# EAGLE design LedPanel (EAGLE 6.5.0)
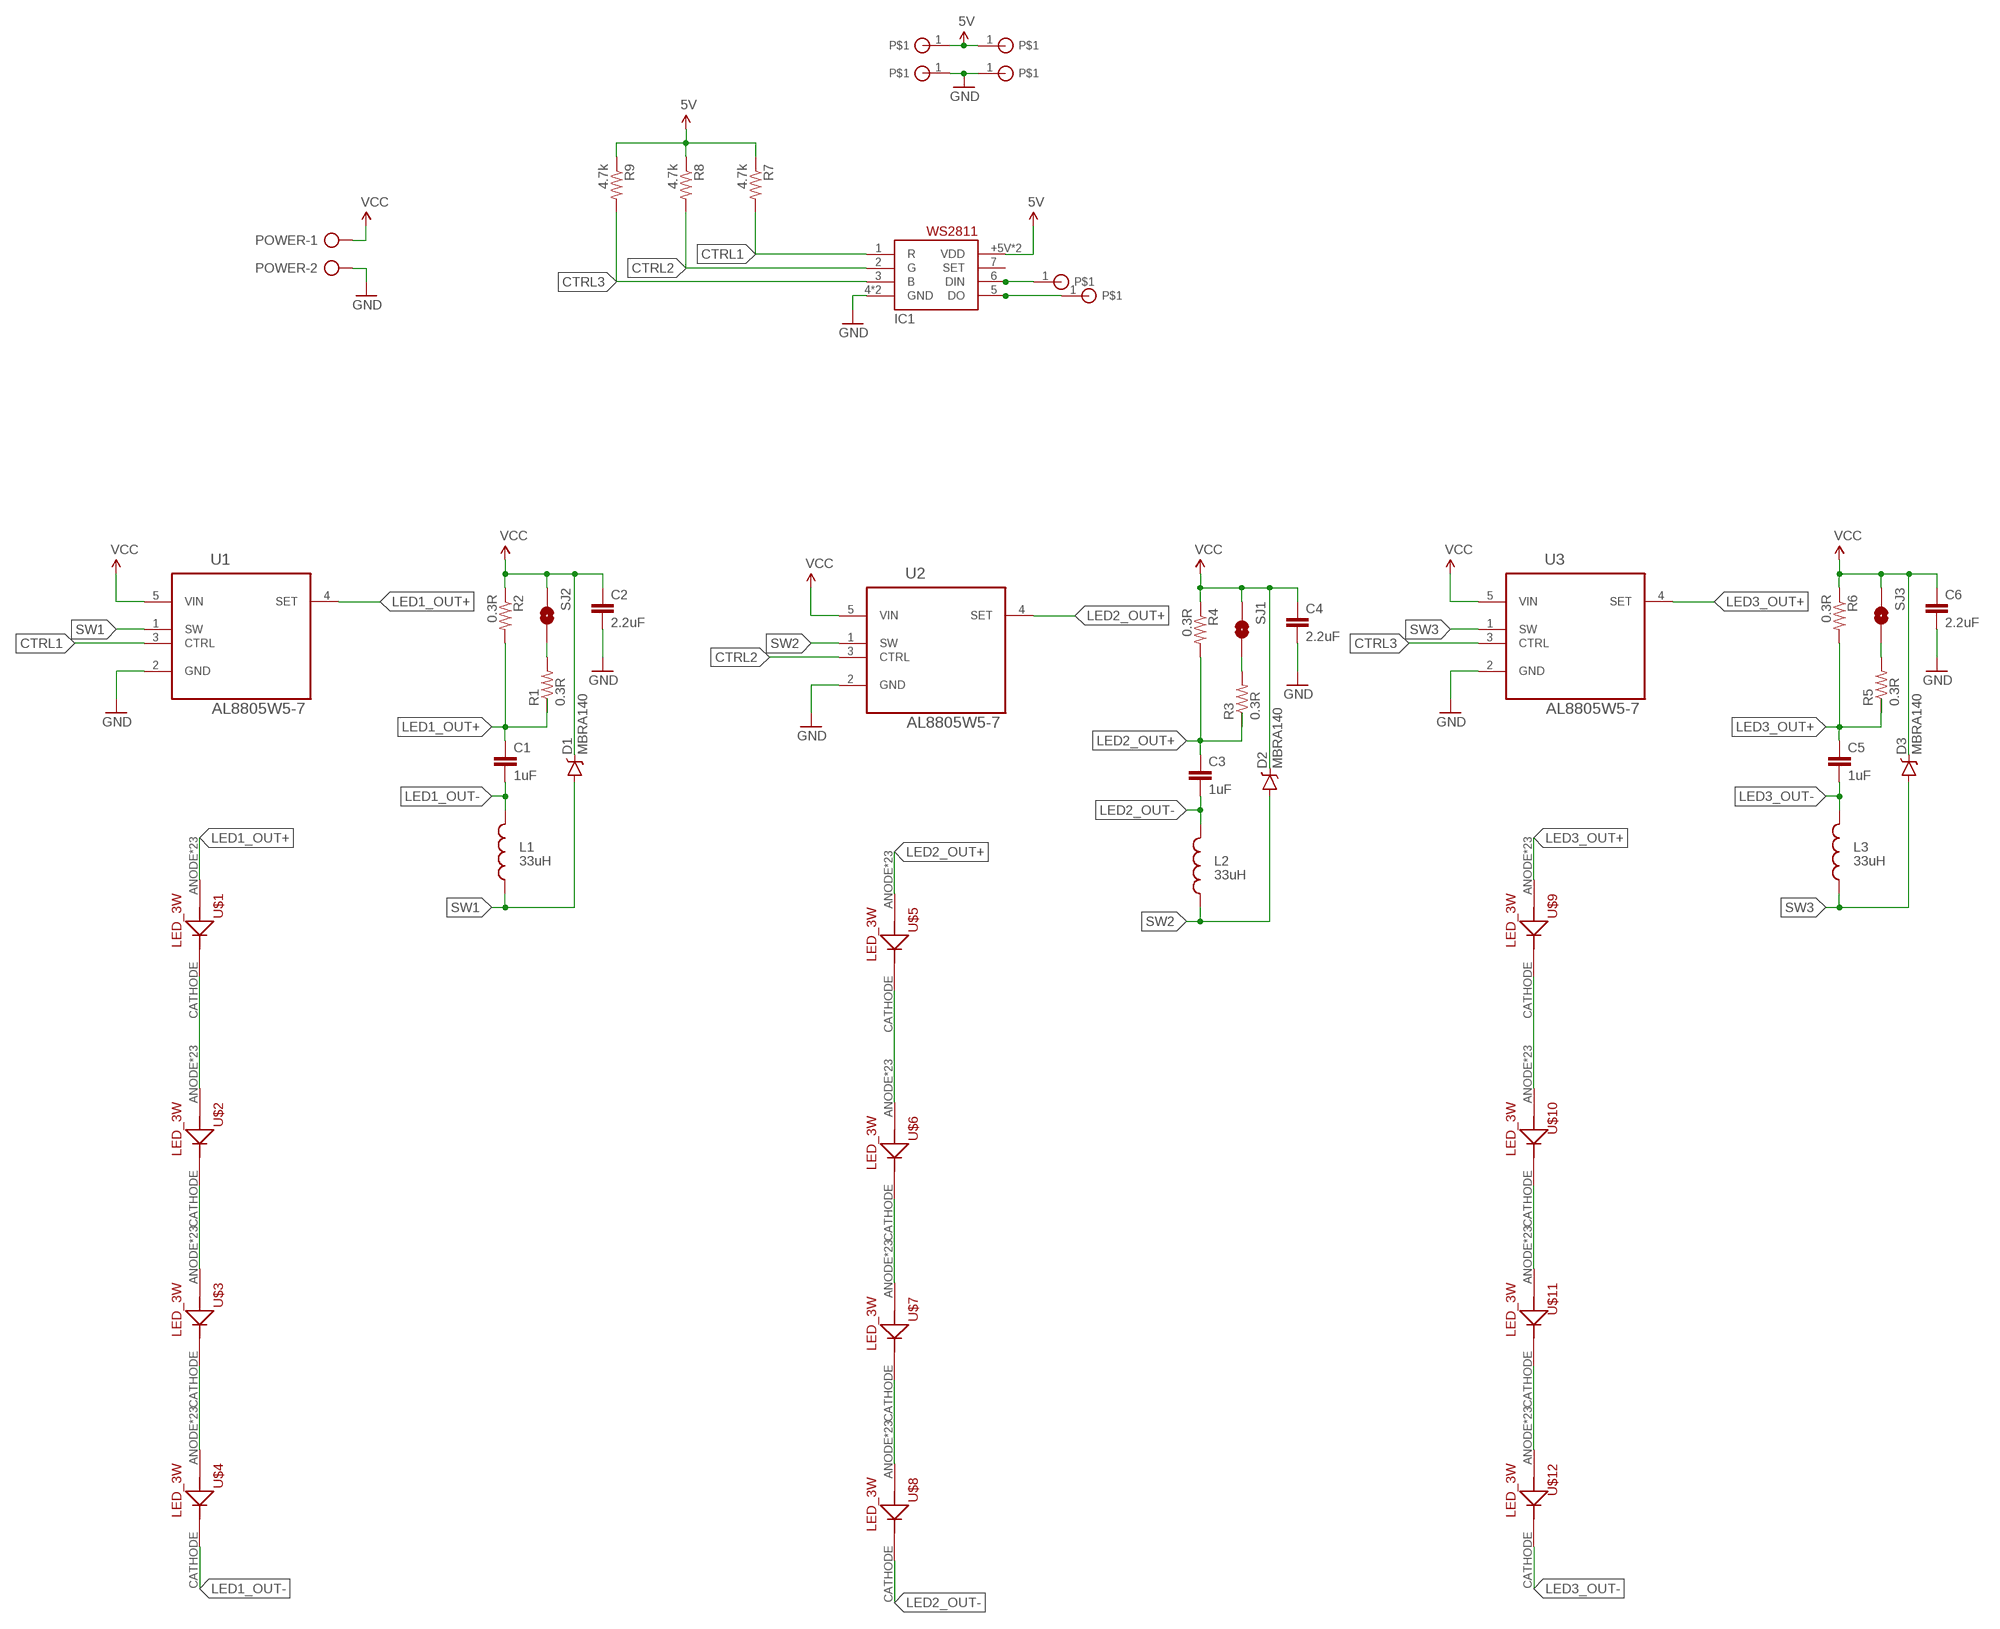
[diagram p0: schematic, sheet 1]

## Parts
5V  5V  SOLDER_PAD  [SOLDER_PAD]
C1  1uF  1.0UF50V10%(1206)  [1206-CAP]
C2  2.2uF  2.2UF50V10%(1206)  [1206-CAP]
C3  1uF  1.0UF50V10%(1206)  [1206-CAP]
C4  2.2uF  2.2UF50V10%(1206)  [1206-CAP]
C5  1uF  1.0UF50V10%(1206)  [1206-CAP]
C6  2.2uF  2.2UF50V10%(1206)  [1206-CAP]
D1  MBRA140  DIODE-SCHOTTKY-MBRA140  [SMA-DIODE]
D2  MBRA140  DIODE-SCHOTTKY-MBRA140  [SMA-DIODE]
D3  MBRA140  DIODE-SCHOTTKY-MBRA140  [SMA-DIODE]
DI  DI  SOLDER_PAD  [SOLDER_PAD]
DO  DO  SOLDER_PAD  [SOLDER_PAD]
IC1  WS2811-SOP8  [SO08-SKINNYPADS]
L1  33uH  INDUCTORBOURNS_SRN6045  [SRN6045]
L2  33uH  INDUCTORBOURNS_SRN6045  [SRN6045]
L3  33uH  INDUCTORBOURNS_SRN6045  [SRN6045]
POWER  AK500/2  [AK500/2]
R1  0.3R  0.3OHM-1/8W-1%(0805)  [0805]
R2  0.3R  0.3OHM-1/8W-1%(0805)  [0805]
R3  0.3R  0.3OHM-1/8W-1%(0805)  [0805]
R4  0.3R  0.3OHM-1/8W-1%(0805)  [0805]
R5  0.3R  0.3OHM-1/8W-1%(0805)  [0805]
R6  0.3R  0.3OHM-1/8W-1%(0805)  [0805]
R7  4.7k  0.3OHM-1/8W-1%(0805)  [0805]
R8  4.7k  0.3OHM-1/8W-1%(0805)  [0805]
R9  4.7k  0.3OHM-1/8W-1%(0805)  [0805]
SJ1  NO Jumper  JUMPER-PAD-2-NO  [PAD-JUMPER-2-NO_NO_SILK]
SJ2  NO Jumper  JUMPER-PAD-2-NO  [PAD-JUMPER-2-NO_NO_SILK]
SJ3  NO Jumper  JUMPER-PAD-2-NO  [PAD-JUMPER-2-NO_NO_SILK]
U1  AL8805W5-7  [SOT95P280X130-5N]
U2  AL8805W5-7  [SOT95P280X130-5N]
U3  AL8805W5-7  [SOT95P280X130-5N]
U$1  LED_3W  [LED_3W]
U$2  LED_3W  [LED_3W]
U$3  LED_3W  [LED_3W]
U$4  LED_3W  [LED_3W]
U$5  LED_3W  [LED_3W]
U$6  LED_3W  [LED_3W]
U$7  LED_3W  [LED_3W]
U$8  LED_3W  [LED_3W]
U$9  LED_3W  [LED_3W]
U$10  LED_3W  [LED_3W]
U$11  LED_3W  [LED_3W]
U$12  LED_3W  [LED_3W]
U$15  GND  SOLDER_PAD  [SOLDER_PAD]
U$16  5V  SOLDER_PAD  [SOLDER_PAD]
U$18  GND  SOLDER_PAD  [SOLDER_PAD]

## Nets
5V: 5V.1 IC1.8(VDD) IC1.+5V(VDD) R7.1 R8.1 R9.1 U$16.1
CTRL1: IC1.1(R) R7.2 U1.3(CTRL)
CTRL2: IC1.2(G) R8.2 U2.3(CTRL)
CTRL3: IC1.3(B) R9.2 U3.3(CTRL)
GND: C2.2 C4.2 C6.2 IC1.4(GND) IC1.GND POWER.2 U1.2(GND) U2.2(GND) U3.2(GND) U$15.1 U$18.1
LED1_OUT+: C1.1 R1.1 R2.2 U1.4(SET) U$1.ANODE U$1.P$1(ANODE) U$1.P$2(ANODE) U$1.P$3(ANODE) U$1.P$4(ANODE) U$1.P$5(ANODE) U$1.P$6(ANODE) U$1.P$7(ANODE) U$1.P$8(ANODE) U$1.P$9(ANODE) U$1.P$10(ANODE) U$1.P$11(ANODE) U$1.P$12(ANODE) U$1.P$13(ANODE) U$1.P$14(ANODE) U$1.P$15(ANODE) U$1.P$16(ANODE) U$1.P$17(ANODE) U$1.P$18(ANODE) U$1.P$19(ANODE) U$1.P$20(ANODE) U$1.P$21(ANODE) U$1.SLUG(ANODE)
LED1_OUT- [power]: C1.2 L1.2 U$4.CATHODE
LED2_OUT+: C3.1 R3.1 R4.2 U2.4(SET) U$5.ANODE U$5.P$1(ANODE) U$5.P$2(ANODE) U$5.P$3(ANODE) U$5.P$4(ANODE) U$5.P$5(ANODE) U$5.P$6(ANODE) U$5.P$7(ANODE) U$5.P$8(ANODE) U$5.P$9(ANODE) U$5.P$10(ANODE) U$5.P$11(ANODE) U$5.P$12(ANODE) U$5.P$13(ANODE) U$5.P$14(ANODE) U$5.P$15(ANODE) U$5.P$16(ANODE) U$5.P$17(ANODE) U$5.P$18(ANODE) U$5.P$19(ANODE) U$5.P$20(ANODE) U$5.P$21(ANODE) U$5.SLUG(ANODE)
LED2_OUT- [power]: C3.2 L2.2 U$8.CATHODE
LED3_OUT+: C5.1 R5.1 R6.2 U3.4(SET) U$9.ANODE U$9.P$1(ANODE) U$9.P$2(ANODE) U$9.P$3(ANODE) U$9.P$4(ANODE) U$9.P$5(ANODE) U$9.P$6(ANODE) U$9.P$7(ANODE) U$9.P$8(ANODE) U$9.P$9(ANODE) U$9.P$10(ANODE) U$9.P$11(ANODE) U$9.P$12(ANODE) U$9.P$13(ANODE) U$9.P$14(ANODE) U$9.P$15(ANODE) U$9.P$16(ANODE) U$9.P$17(ANODE) U$9.P$18(ANODE) U$9.P$19(ANODE) U$9.P$20(ANODE) U$9.P$21(ANODE) U$9.SLUG(ANODE)
LED3_OUT- [power]: C5.2 L3.2 U$12.CATHODE
N$1: U$3.CATHODE U$4.ANODE U$4.P$1(ANODE) U$4.P$2(ANODE) U$4.P$3(ANODE) U$4.P$4(ANODE) U$4.P$5(ANODE) U$4.P$6(ANODE) U$4.P$7(ANODE) U$4.P$8(ANODE) U$4.P$9(ANODE) U$4.P$10(ANODE) U$4.P$11(ANODE) U$4.P$12(ANODE) U$4.P$13(ANODE) U$4.P$14(ANODE) U$4.P$15(ANODE) U$4.P$16(ANODE) U$4.P$17(ANODE) U$4.P$18(ANODE) U$4.P$19(ANODE) U$4.P$20(ANODE) U$4.P$21(ANODE) U$4.SLUG(ANODE)
N$2: U$2.CATHODE U$3.ANODE U$3.P$1(ANODE) U$3.P$2(ANODE) U$3.P$3(ANODE) U$3.P$4(ANODE) U$3.P$5(ANODE) U$3.P$6(ANODE) U$3.P$7(ANODE) U$3.P$8(ANODE) U$3.P$9(ANODE) U$3.P$10(ANODE) U$3.P$11(ANODE) U$3.P$12(ANODE) U$3.P$13(ANODE) U$3.P$14(ANODE) U$3.P$15(ANODE) U$3.P$16(ANODE) U$3.P$17(ANODE) U$3.P$18(ANODE) U$3.P$19(ANODE) U$3.P$20(ANODE) U$3.P$21(ANODE) U$3.SLUG(ANODE)
N$3: U$1.CATHODE U$2.ANODE U$2.P$1(ANODE) U$2.P$2(ANODE) U$2.P$3(ANODE) U$2.P$4(ANODE) U$2.P$5(ANODE) U$2.P$6(ANODE) U$2.P$7(ANODE) U$2.P$8(ANODE) U$2.P$9(ANODE) U$2.P$10(ANODE) U$2.P$11(ANODE) U$2.P$12(ANODE) U$2.P$13(ANODE) U$2.P$14(ANODE) U$2.P$15(ANODE) U$2.P$16(ANODE) U$2.P$17(ANODE) U$2.P$18(ANODE) U$2.P$19(ANODE) U$2.P$20(ANODE) U$2.P$21(ANODE) U$2.SLUG(ANODE)
N$4: U$7.CATHODE U$8.ANODE U$8.P$1(ANODE) U$8.P$2(ANODE) U$8.P$3(ANODE) U$8.P$4(ANODE) U$8.P$5(ANODE) U$8.P$6(ANODE) U$8.P$7(ANODE) U$8.P$8(ANODE) U$8.P$9(ANODE) U$8.P$10(ANODE) U$8.P$11(ANODE) U$8.P$12(ANODE) U$8.P$13(ANODE) U$8.P$14(ANODE) U$8.P$15(ANODE) U$8.P$16(ANODE) U$8.P$17(ANODE) U$8.P$18(ANODE) U$8.P$19(ANODE) U$8.P$20(ANODE) U$8.P$21(ANODE) U$8.SLUG(ANODE)
N$5: U$6.CATHODE U$7.ANODE U$7.P$1(ANODE) U$7.P$2(ANODE) U$7.P$3(ANODE) U$7.P$4(ANODE) U$7.P$5(ANODE) U$7.P$6(ANODE) U$7.P$7(ANODE) U$7.P$8(ANODE) U$7.P$9(ANODE) U$7.P$10(ANODE) U$7.P$11(ANODE) U$7.P$12(ANODE) U$7.P$13(ANODE) U$7.P$14(ANODE) U$7.P$15(ANODE) U$7.P$16(ANODE) U$7.P$17(ANODE) U$7.P$18(ANODE) U$7.P$19(ANODE) U$7.P$20(ANODE) U$7.P$21(ANODE) U$7.SLUG(ANODE)
N$6: R1.2 SJ2.2
N$7: U$5.CATHODE U$6.ANODE U$6.P$1(ANODE) U$6.P$2(ANODE) U$6.P$3(ANODE) U$6.P$4(ANODE) U$6.P$5(ANODE) U$6.P$6(ANODE) U$6.P$7(ANODE) U$6.P$8(ANODE) U$6.P$9(ANODE) U$6.P$10(ANODE) U$6.P$11(ANODE) U$6.P$12(ANODE) U$6.P$13(ANODE) U$6.P$14(ANODE) U$6.P$15(ANODE) U$6.P$16(ANODE) U$6.P$17(ANODE) U$6.P$18(ANODE) U$6.P$19(ANODE) U$6.P$20(ANODE) U$6.P$21(ANODE) U$6.SLUG(ANODE)
N$8: R3.2 SJ1.2
N$9: U$11.CATHODE U$12.ANODE U$12.P$1(ANODE) U$12.P$2(ANODE) U$12.P$3(ANODE) U$12.P$4(ANODE) U$12.P$5(ANODE) U$12.P$6(ANODE) U$12.P$7(ANODE) U$12.P$8(ANODE) U$12.P$9(ANODE) U$12.P$10(ANODE) U$12.P$11(ANODE) U$12.P$12(ANODE) U$12.P$13(ANODE) U$12.P$14(ANODE) U$12.P$15(ANODE) U$12.P$16(ANODE) U$12.P$17(ANODE) U$12.P$18(ANODE) U$12.P$19(ANODE) U$12.P$20(ANODE) U$12.P$21(ANODE) U$12.SLUG(ANODE)
N$10: U$10.CATHODE U$11.ANODE U$11.P$1(ANODE) U$11.P$2(ANODE) U$11.P$3(ANODE) U$11.P$4(ANODE) U$11.P$5(ANODE) U$11.P$6(ANODE) U$11.P$7(ANODE) U$11.P$8(ANODE) U$11.P$9(ANODE) U$11.P$10(ANODE) U$11.P$11(ANODE) U$11.P$12(ANODE) U$11.P$13(ANODE) U$11.P$14(ANODE) U$11.P$15(ANODE) U$11.P$16(ANODE) U$11.P$17(ANODE) U$11.P$18(ANODE) U$11.P$19(ANODE) U$11.P$20(ANODE) U$11.P$21(ANODE) U$11.SLUG(ANODE)
N$11: U$9.CATHODE U$10.ANODE U$10.P$1(ANODE) U$10.P$2(ANODE) U$10.P$3(ANODE) U$10.P$4(ANODE) U$10.P$5(ANODE) U$10.P$6(ANODE) U$10.P$7(ANODE) U$10.P$8(ANODE) U$10.P$9(ANODE) U$10.P$10(ANODE) U$10.P$11(ANODE) U$10.P$12(ANODE) U$10.P$13(ANODE) U$10.P$14(ANODE) U$10.P$15(ANODE) U$10.P$16(ANODE) U$10.P$17(ANODE) U$10.P$18(ANODE) U$10.P$19(ANODE) U$10.P$20(ANODE) U$10.P$21(ANODE) U$10.SLUG(ANODE)
N$12: R5.2 SJ3.2
N$13: DI.1 IC1.6(DIN)
N$14: DO.1 IC1.5(DO)
SW1: D1.A L1.1 U1.1(SW)
SW2: D2.A L2.1 U2.1(SW)
SW3: D3.A L3.1 U3.1(SW)
VCC: C2.1 C4.1 C6.1 D1.C D2.C D3.C POWER.1 R2.1 R4.1 R6.1 SJ1.1 SJ2.1 SJ3.1 U1.5(VIN) U2.5(VIN) U3.5(VIN)
Unconnected: IC1.7(SET)

## Library data of the parts
5V DI DO U$15 U$16 U$18 = LedPanel:SOLDER_PAD
C1 C3 C5 = SparkFun-Capacitors:1.0UF50V10%(1206): CAP-09822
C2 C4 C6 = SparkFun-Capacitors:2.2UF50V10%(1206): CAP-10009
D1-D3 = SparkFun-DiscreteSemi:DIODE-SCHOTTKY: Schottky diodes in SFE's production catalog BAT20J 1A 23V 0.62Vf RB751 120mA 40V 0.37Vf PMEG4005EJ 0.5A 40V 0.42Vf MBRA140 1A 40V 0.5Vf B340A 3A 40V SMA; PROD_ID: DIO-08053
IC1 = LedPanel:WS2811
L1-L3 = SparkFun-Passives:INDUCTOR: Inductors Basic Inductor/Choke - 0603 and 1206. Footprints are not proven and vary greatly between part numbers. INDUCTOR POWER 3.3UH 4.0A SMD 0.197" L x 0.197" W x 0.177" H (5.00mm x 5.00mm x 4.50mm); PROD_ID: NDUC-11627
POWER = LedPanel:AK500/2: CONNECTOR; OC_FARNELL: unknown; OC_NEWARK: unknown
R1-R9 = SparkFun-Resistors:0.3OHM-1/8W-1%(0805): RES-11622; PROD_ID: RES-11622; VALUE: 0.3
SJ1-SJ3 = SparkFun-Passives:JUMPER-PAD-2-NO
U1-U3 = LedPanel:AL8805W5-7: HIGH EFFICIENCY 30V 1A BUCK LED DRIVER; MPN: AL8805W5-7; OC_FARNELL: 1904023; OC_NEWARK: 55T1754; PACKAGE: SOT-23-5; SUPPLIER: DIODES INC.
U$1-U$12 = LedPanel:LED_3W: 3W Led footprint optimized for heat disipation

## Net classes
0 default: width 0.152 mm, drill 0.305 mm, clearance 0.152 mm
1 power: width 0.152 mm, drill 0.305 mm, clearance 0.152 mm

## Board
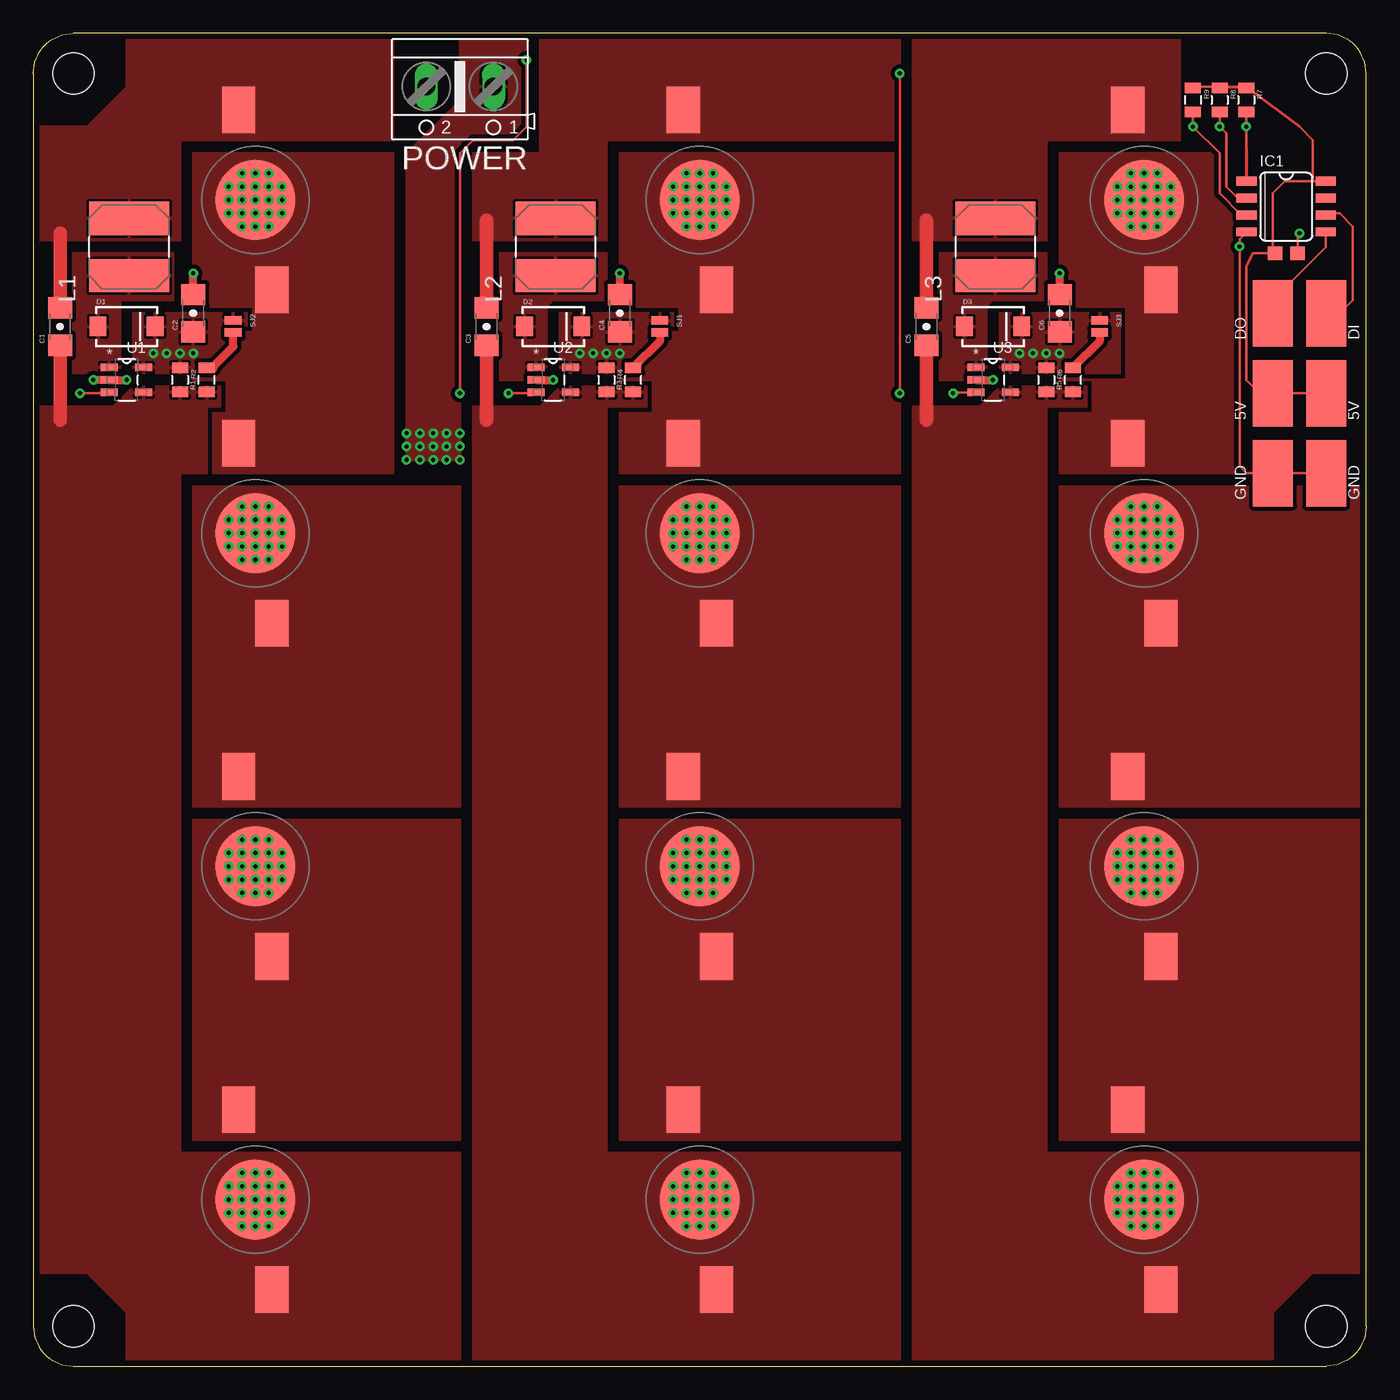
[diagram p1: board, top side]
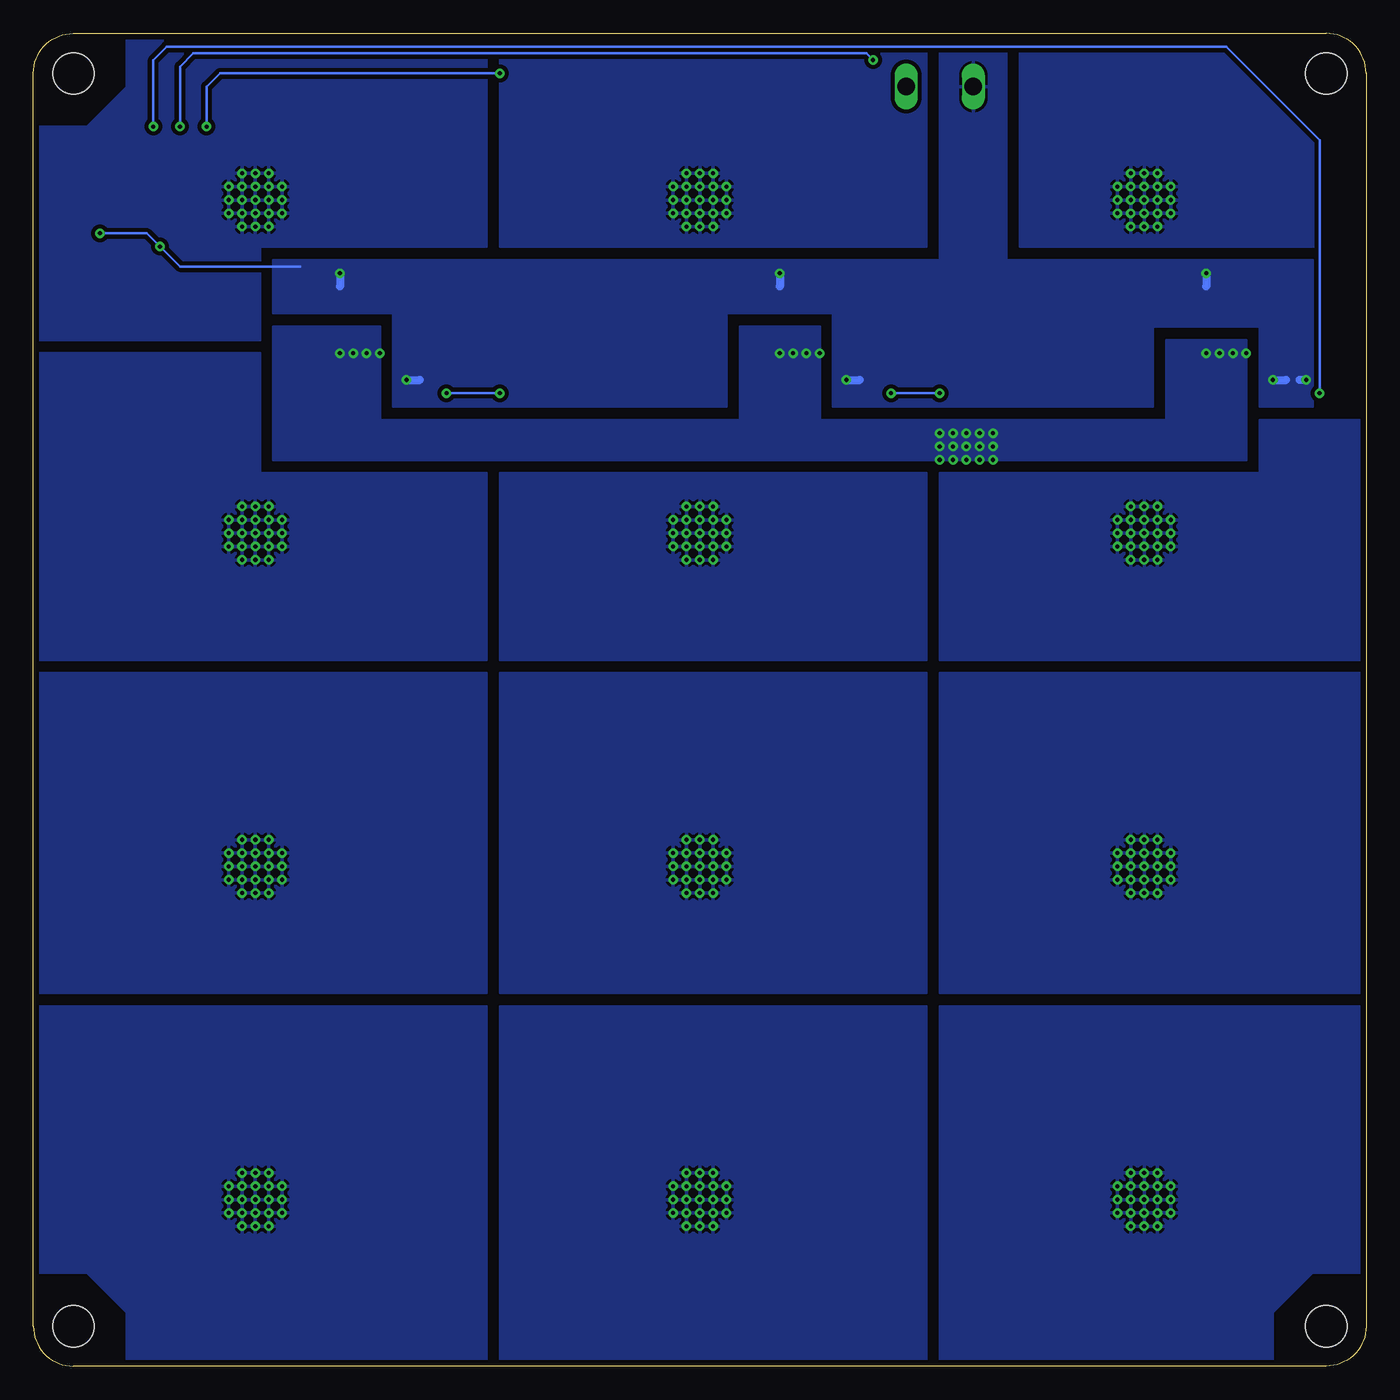
[diagram p2: board, bottom side, seen from below]

Size 100 x 100 mm. Coordinates in mm from the lower left corner, seen from the top.
Outline: 3,0 97,0 arc90 100,3 100,97 arc90 97,100 3,100 arc90 0,97 0,3 arc90 3,0
Copper layers (1*16): Top 0.018mm / dielectric 1.55mm / Bottom 0.018mm
Design rules "eC-PCB_proto-2-layer": minimum track width 0.15mm, minimum drill 0.25mm, track to track 0.15mm, track to pad 0.15mm, pad to pad 0.15mm, via to via 0.15mm, smd to smd 0.15mm, copper to edge 0.45mm, drill to drill 0.3mm, minimum pad ring 0.2mm, minimum via ring 0.2mm, stop-mask expansion 0.1mm, vias tented up to drill 0mil, thermal gap 0.2mm
Holes 3.1 mm at 3,97 97,97 3,3 97,3

### Footprints (pad centres in the part's own frame; a part is rotated, then mirrored left to right if it is on the bottom)
SOLDER_PAD = smd 3 x 5: 1 0,0
1206-CAP = smd 1.6 x 1.8: 1 -1.4,0; 2 1.4,0
SMA-DIODE = smd 1.27 x 1.47: A -2.15,0; C 2.15,0
SO08-SKINNYPADS = smd 0.66 x 1.524: 1 -1.905,-2.973; 2 -0.635,-2.973; 3 0.635,-2.973; 4 1.905,-2.973; 5 1.905,2.973; 6 0.635,2.973; 7 -0.635,2.973; 8 -1.905,2.973 | smd 1 x 1.1: +5V 3.5,-0.85; GND 3.5,0.85
SRN6045 = smd 2.5 x 6: 1 -2.175,-0.175; 2 2.125,-0.175
AK500/2 = drill 1.321 long: 1 -2.515,0; 2 2.515,0
0805 = smd 0.8 x 1.2: 1 -0.9,0; 2 0.9,0
PAD-JUMPER-2-NO_NO_SILK = smd 0.635 x 1.27: 1 -0.45,0; 2 0.45,0
SOT95P280X130-5N = smd 1.27 x 0.559: 1 -1.295,0.94; 2 -1.295,0; 3 -1.295,-0.94; 4 1.295,-0.94; 5 1.295,0.94
LED_3W = smd 3.5 x 2.5: ANODE 6.75,1.25; CATHODE -6.75,-1.25 | drill 0.31: P$1 -2,-1; P$2 -1,-1; P$3 0,-1; P$4 1,-1; P$5 2,-1; P$6 2,0; P$7 1,0; P$8 0,0; P$9 -1,0; P$10 -2,0; P$11 -2,1; P$12 -1,1; P$13 0,1; P$14 1,1; P$15 2,1; P$16 -1,2; P$17 0,2; P$18 1,2; P$19 -1,-2; P$20 0,-2; P$21 1,-2 | smd 6 x 6: SLUG 0,0

### Placement (x,y rotation side)
5V  97,73 0 top
C1  2,78 90 top
C2  12,79 90 top
C3  34,78 90 top
C4  44,79 90 top
C5  67,78 90 top
C6  77,79 90 top
D1  7,78 0 top
D2  39,78 0 top
D3  72,78 0 top
DI  97,79 0 top
DO  93,79 0 top
IC1  94,87 270 top
L1  7,84 90 top
L2  39,84 90 top
L3  72,84 90 top
POWER  32,96 180 top
R1  13,74 90 top
R2  11,74 270 top
R3  45,74 90 top
R4  43,74 270 top
R5  78,74 90 top
R6  76,74 270 top
R7  91,95 270 top
R8  89,95 270 top
R9  87,95 270 top
SJ1  47,78 270 top
SJ2  15,78 270 top
SJ3  80,78 270 top
U1  7,74 0 top
U2  39,74 0 top
U3  72,74 0 top
U$1  16.66,12.5 270 top
U$2  16.66,37.5 270 top
U$3  16.66,62.5 270 top
U$4  16.66,87.5 270 top
U$5  50,12.5 270 top
U$6  50,37.5 270 top
U$7  50,62.5 270 top
U$8  50,87.5 270 top
U$9  83.34,12.5 270 top
U$10  83.34,37.5 270 top
U$11  83.34,62.5 270 top
U$12  83.34,87.5 270 top
U$15  97,67 0 top
U$16  93,73 0 top
U$18  93,67 0 top

### Tracks (layer width: path | path; a pad name or v marks a point on that pad's centre or on a via)
5V
  Top 0.203: IC1.8 96,88.91 | 96,88.91 93.91,88.91 93,88 93,83.65 IC1.+5V 91.5,83.5 91,82.5 91,74 92,73 5V.1 U$16.1 | 91,96 95,93 96,92 96,88.91 | R8.1 91,96 | 91,96 89.1,96 R7.1 89,96 87.1,96 R9.1
CTRL1  (via drill 0.31)
  Top 0.203: U1.3 5.64,73 v3.5,73 | v91,93 91,89 91.03,88.97 IC1.1 91.03,89.97 v91,93 | v91,93 R7.2
  Bottom 0.203: v91,93 91,98 90,99 10.5,99 3.5,92 v3.5,73
CTRL2  (via drill 0.31)
  Top 0.203: IC1.2 90.36,87.64 89.5,88.5 89.5,92.5 v89,93 R8.2 | v37,98 37,93 36,92 33,92 32,91 v32,73 | v35.64,73 38,73 U2.3
  Bottom 0.203: v89,93 89,97.5 88,98.5 37.5,98.5 v37,98 | v32,73 v35.64,73
CTRL3  (via drill 0.31)
  Top 0.203: IC1.3 90.64,86.36 89,88 89,91 v87,93 R9.2 | v65,97 v65,73 | U3.3 69.06,73.06 v69,73
  Bottom 0.203: v87,93 87,96 86,97 v65,97 | v65,73 v69,73
GND  (via drill 0.31)
  Top 0.203: U$15.1 U$18.1 91,67 90.5,67.5 v90.5,84 90.5,84.57 IC1.4 | IC1.GND 94.85,84.85 v95,85
  Top 0.61: v4.5,74 U1.2 v7,74 | C2.2 v12,82 | U2.2 v39,74 | C4.2 v44,82 | U3.2 v72,74 | C6.2 v77,82
  Bottom 0.203: v95,85 91.5,85 v90.5,84 89,82.5 80,82.5
  Bottom 0.61: v4.5,74 5,74 | v7,74 6,74 | v12,82 12,81 | v39,74 38,74 | v44,82 44,81 | v72,74 71,74 | v77,82 77,81
  pour Bottom (isolate 0.305): 4,83 27,83 27,100 32,100 32,83 82,83 82,79 73,79 73,72 48,72 48,79 40,79 40,72 16,72 16,78 8,78 8,72 4,72
LED1_OUT+
  Top 1.016: C1.1 2,71
  pour Top (isolate 0.305, rank 2): 0,72 6,72 7.5,73.5 14,73.5 14,72 13,72 13,67 11,67 11,16 32,16 32,0 7,0 7,4 4,7 0,7
  pour Bottom (isolate 0.305): 32,27 0,27 0,7 4,7 7,4 7,0 32,0
LED1_OUT-
  Top 1.016: C1.2 2,85
  pour Top (isolate 0.305, rank 2): 0,84.5 11,84.5 11,92 27,92 27,100 7,100 7,96 4,93 0,93
LED2_OUT+
  Top 1.016: C3.1 34,71
  pour Top (isolate 0.305): 33,0 65,0 65,16 43,16 43,72 46,72 46,73.5 39.5,73.5 38,72 33,72
  pour Bottom (isolate 0.305): 33,27 65,27 65,0 33,0
LED2_OUT-
  Top 1.016: C3.2 34,86
  pour Top (isolate 0.305): 33,84.5 43,84.5 43,92 65,92 65,100 38,100 38,91 33,91
LED3_OUT+
  Top 1.016: C5.1 67,71
  pour Top (isolate 0.305): 66,0 93,0 93,4 96,7 100,7 100,16 76,16 76,72 79,72 79,73.5 72.5,73.5 71,72 66,72
  pour Bottom (isolate 0.305): 66,0 93,0 93,4 96,7 100,7 100,27 66,27 66,1
LED3_OUT-
  Top 1.016: C5.2 67,86
  pour Top (isolate 0.305): 86,92 86,100 66,100 66,84.5 76,84.5 76,92
N$1
  pour Top (isolate 0.305, rank 3): 12,67 27,67 27,91 12,91
  pour Bottom (isolate 0.305): 26,84 26,100 7,100 7,96 4,93 1,93 0,93 0,84
N$2
  pour Top (isolate 0.305): 12,42 32,42 32,66 12,66
  pour Bottom (isolate 0.305): 32,53 32,67 8,67 8,71 0,71 0,53
N$3
  pour Top (isolate 0.305): 12,41 32,41 32,17 12,17
  pour Bottom (isolate 0.305): 0,28 32,28 32,52 0,52
N$4
  pour Top (isolate 0.305, rank 3): 44,67 65,67 65,91 44,91
  pour Bottom (isolate 0.305): 65,84 65,100 33,100 33,84
N$5
  pour Top (isolate 0.305): 44,42 65,42 65,66 44,66
  pour Bottom (isolate 0.305): 33,53 65,53 65,67 33,67
N$6
  Top 0.61: 13.4,74.9 15,76.5 SJ2.2
  Top 0.813: R1.2 13.4,74.9
N$7
  pour Top (isolate 0.305): 44,17 65,17 65,41 44,41
  pour Bottom (isolate 0.305): 33,28 65,28 65,52 33,52
N$8
  Top 0.61: SJ1.2 47,76.9 R3.2
N$9
  pour Top (isolate 0.305, rank 3): 77,67 93,67 93,91 77,91
  pour Bottom (isolate 0.305): 83,77 100,77 100,93 96,93 93,96 93,100 66,100 66,84 83,84
N$10
  pour Top (isolate 0.305): 77,42 100,42 100,66 77,66
  pour Bottom (isolate 0.305): 66,53 100,53 100,76 83,76 83,67 66,67
N$11
  pour Top (isolate 0.305): 77,17 100,17 100,41 77,41
  pour Bottom (isolate 0.305): 66,28 100,28 100,52 66,52
N$12
  Top 0.61: SJ3.2 80,76.9 R5.2
N$13
  Top 0.203: DI.1 98,79 99,80 99,85.5 98,86.5 97.11,86.5 IC1.6
N$14
  Top 0.203: IC1.5 96.97,83.97 93,80 DO.1 93,78.5
SW1
  pour Top (isolate 0.305): 3,74.5 6.5,74.5 6.5,80 10.5,80 10.5,83.5 3,83.5
SW2
  pour Top (isolate 0.305): 35,74 37.5,74 38.5,75 38.5,79.5 39,80 43,80 43,83.5 35,83.5
SW3
  pour Top (isolate 0.305): 68,83.5 68,74 71.5,74 71.5,79.5 72,80 76,80 76,83.5
VCC  (via drill 0.31)
  other vias: 29,70 30,70 31,70 31,69 30,69 29,69 29,68 30,68 31,68 32,70 32,69 32,68 28,69 28,68 28,70 75,76 76,76 77,76 74,76 41,76 42,76 43,76 44,76 9,76 10,76 11,76 12,76
  pour Top (isolate 0.305): 16,74.5 7.5,74.5 7.5,79 16,79
  pour Top (isolate 0.305): 39.5,79 39.5,74.5 48,74.5 48,79
  pour Top (isolate 0.305): 81.5,79 72.5,79 72.5,74.5 81.5,74.5
  pour Top (isolate 0.305): 32,100 37,100 37,92 32,92 32,68 28,68 28,91 32,95
  pour Bottom (isolate 0.305): 82,68 9,68 9,77 15,77 15,71 41,71 41,78 47,78 47,71 74,71 74,78 82,78